# EAGLE design Battlebot_OSMC2 (EAGLE 5.10)
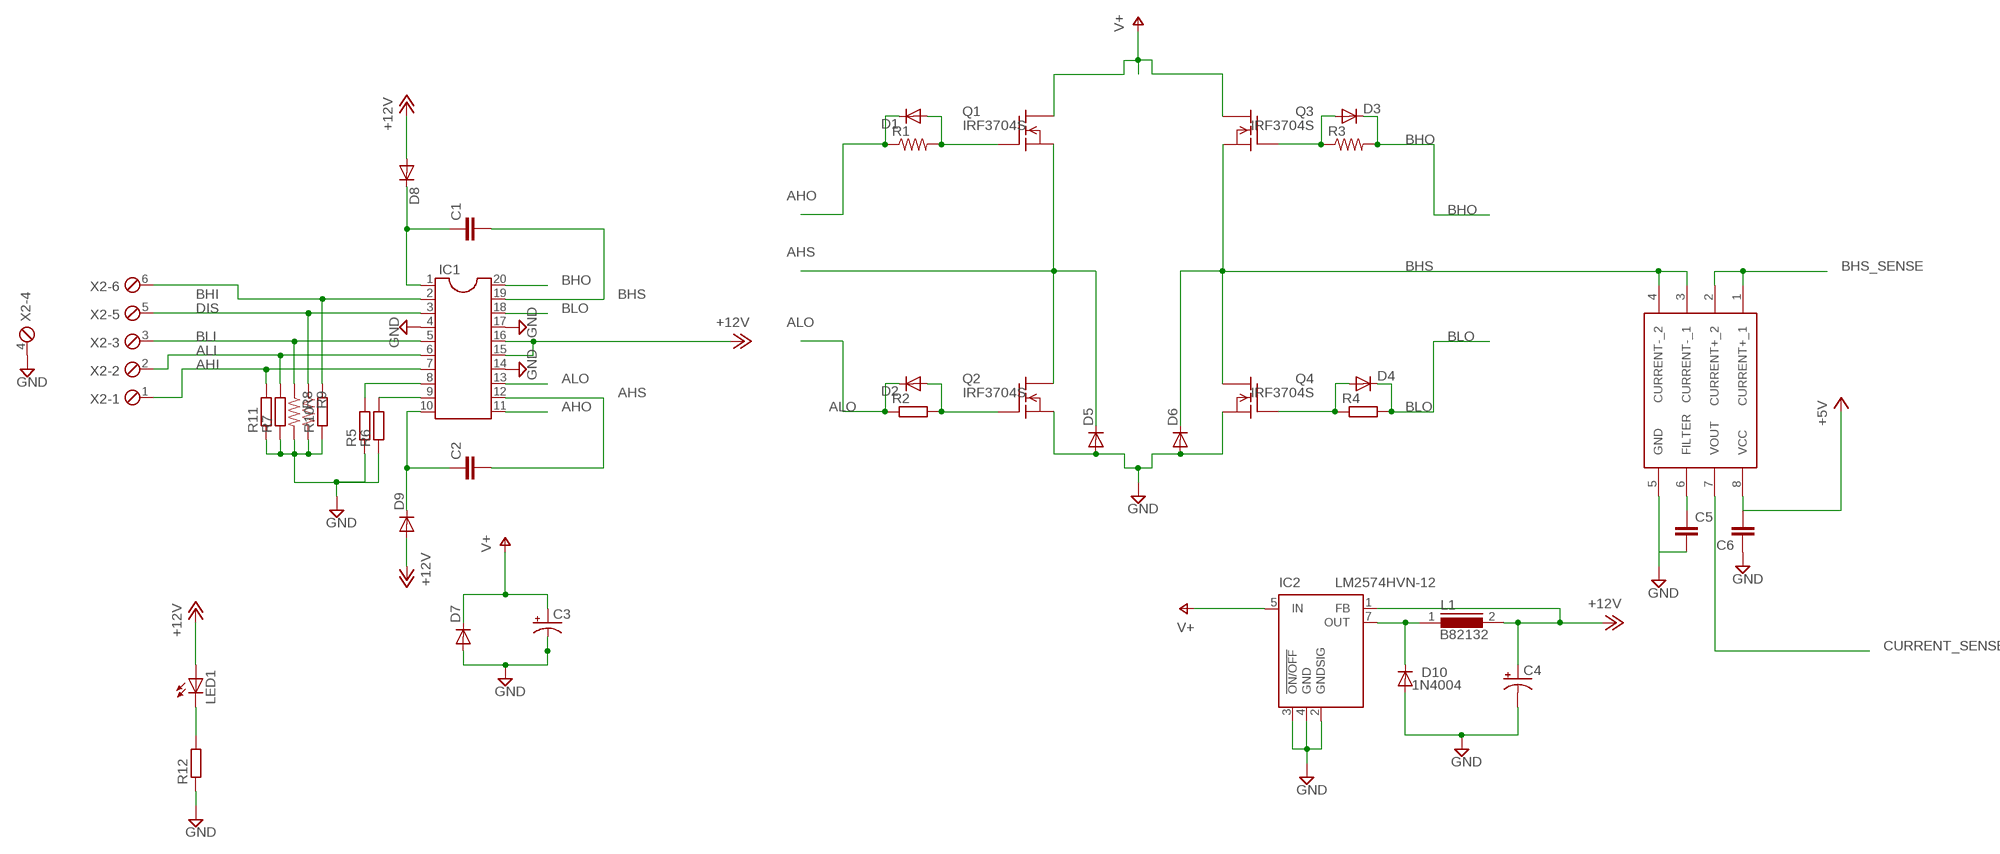
[diagram p0: schematic, sheet 1]

## Parts
C1  C7.5/3  [C7.5B3]
C2  C7.5/3  [C7.5B3]
C3  CPOL-USE5-10.5  [E5-10,5]
C4  CPOL-USE5-10.5  [E5-10,5]
C5  CAPPTH2  [CAP-PTH-SMALL2]
C6  CAPPTH2  [CAP-PTH-SMALL2]
D1  DIODE1N4148  [DIODE-1N4148]
D2  DIODE-D-5  [D-5]
D3  DIODE1N4148  [DIODE-1N4148]
D4  DIODE-D-5  [D-5]
D5  DIODE-C1702-05  [C1702-05]
D6  DIODE-C1702-05  [C1702-05]
D7  DIODE-C1702-05  [C1702-05]
D8  1N4148DO35-7  [DO35-7]
D9  1N4148DO35-7  [DO35-7]
D10  1N4004  [DO41-10]
IC1  DIL20  [DIL20]
IC2  LM2574HVN-12  [DIL08]
L1  B82132  [SUKW2-22]
LED1  LED3MM  [LED3MM]
Q1  IRF3704S  BUZ325V  [TO218V]
Q2  IRF3704S  BUZ325V  [TO218V]
Q3  IRF3704S  BUZ325V  [TO218V]
Q4  IRF3704S  BUZ325V  [TO218V]
R1  RESISTORPTH1  [AXIAL-0.3]
R2  R-EU_0204/5  [0204/5]
R3  RESISTORPTH1  [AXIAL-0.3]
R4  R-EU_0204/5  [0204/5]
R5  R-EU_0204/5  [0204/5]
R6  R-EU_0204/5  [0204/5]
R7  R-EU_0204/5  [0204/5]
R8  R-US_0204/2V  [0204V]
R9  R-US_0204/2V  [0204V]
R10  R-EU_0204/5  [0204/5]
R11  R-EU_0204/5  [0204/5]
R12  R-EU_0204/5  [0204/5]
U$1  ACS714  [ACS714]
X2  MPT6  [6POL254]

## Nets
+5V: C6.2 U$1.8(VCC)
+12V: C4.+ D8.A D9.A IC1.15 IC1.16 IC2.1(FB) L1.2 LED1.A
AHI: IC1.7 R11.2 X2.1
AHO: D1.C IC1.11 R1.P$1
AHS: C2.2 D5.C IC1.12 Q1.3(S) Q2.2(D)
ALI: IC1.6 R7.2 X2.2
ALO: D2.C IC1.13 R2.1
BHI: IC1.2 R10.2 X2.6
BHO: D3.C IC1.20 R3.P$2
BHS: C1.2 D6.C IC1.19 Q3.3(S) Q4.2(D) U$1.3(CURRENT-_1) U$1.4(CURRENT-_2)
BHS_SENSE: U$1.1(CURRENT+_1) U$1.2(CURRENT+_2)
BLI: IC1.5 R8.1 X2.3
BLO: D4.C IC1.18 R4.2
CURRENT_SENSE: U$1.7(VOUT)
DIS: IC1.3 R9.1 X2.5
GND: C3.- C4.- C5.2 C6.1 D5.A D6.A D7.A D10.A IC1.4 IC1.14 IC1.17 IC2.2(GNDSIG) IC2.3(!ON/OFF) IC2.4(GND) Q2.3(S) Q4.3(S) R5.1 R6.1 R7.1 R8.2 R9.2 R10.1 R11.1 R12.1 U$1.5(GND) X2.4
N$1: C2.1 D9.C IC1.10
N$2: C1.1 D8.C IC1.1
N$5: D1.A Q1.1(G) R1.P$2
N$6: D2.A Q2.1(G) R2.2
N$7: D4.A Q4.1(G) R4.1
N$8: D3.A Q3.1(G) R3.P$1
N$9: C5.1 U$1.6(FILTER)
N$10: D10.C IC2.7(OUT) L1.1
N$11: LED1.K(C) R12.2
N$14: IC1.8 R5.2
N$15: IC1.9 R6.2
V+: C3.+ D7.C IC2.5(IN) Q1.2(D) Q3.2(D)

## Library data of the parts
C1 C2 = capacitor-wima:C: CAPACITOR naming: grid - package width
C3 C4 = rcl:CPOL-US: POLARIZED CAPACITOR, American symbol
C5 C6 = SparkFun:CAP: Capacitor Standard 0603 ceramic capacitor, and 0.1" leaded capacitor.
D1 D3 = SparkFun:DIODE: Diode These are standard reverse protection diodes and small signal diodes. SMA package can handle up to about 1A. SOD-323 can handle about 200mA. What the SOD-323 package when ordering, there are some mfgs out there that are 5-pin packages.
D2 D4-D7 = diode:DIODE-: DIODE
D8 D9 = diode:1N4148: DIODE high speed (Philips)
D10 = diode:1N4004: DIODE general purpose rectifier, 1 A
IC1 = ic-package:DIL20: Dual In Line / Socket
IC2 = linear:LM2574?-*: SIMPLE SWITCHER 0.5A Step-Down Voltage Regulator Source: http://cache.national.com/ds/LM/LM2574.pdf
L1 = inductors:B82132: INDUCTOR
LED1 = SparkFun:LED: LEDs Standard schematic elements and footprints for 5mm, 3mm, 1206, and 0603 sized LEDs. 5mm - Spark Fun Electronics SKU : COM-00529 (and others)
Q1-Q4 = transistor-fet:BUZ325: N-Channel Enhancement MOSFET 400V; 10,5A; 0,5Ohm
R1 R3 = SparkFun:RESISTOR: Resistor Basic schematic elements and footprints for 0603, 1206, and PTH 1/10th watt (small) resistors.
R2 R4-R7 R10-R12 = rcl:R-EU_: RESISTOR, European symbol
R8 R9 = rcl:R-US_: RESISTOR, American symbol
U$1 = A-JD3:ACS714
X2 = con-phoenix-254:MPT6: PHOENIX CONNECTOR

## Board
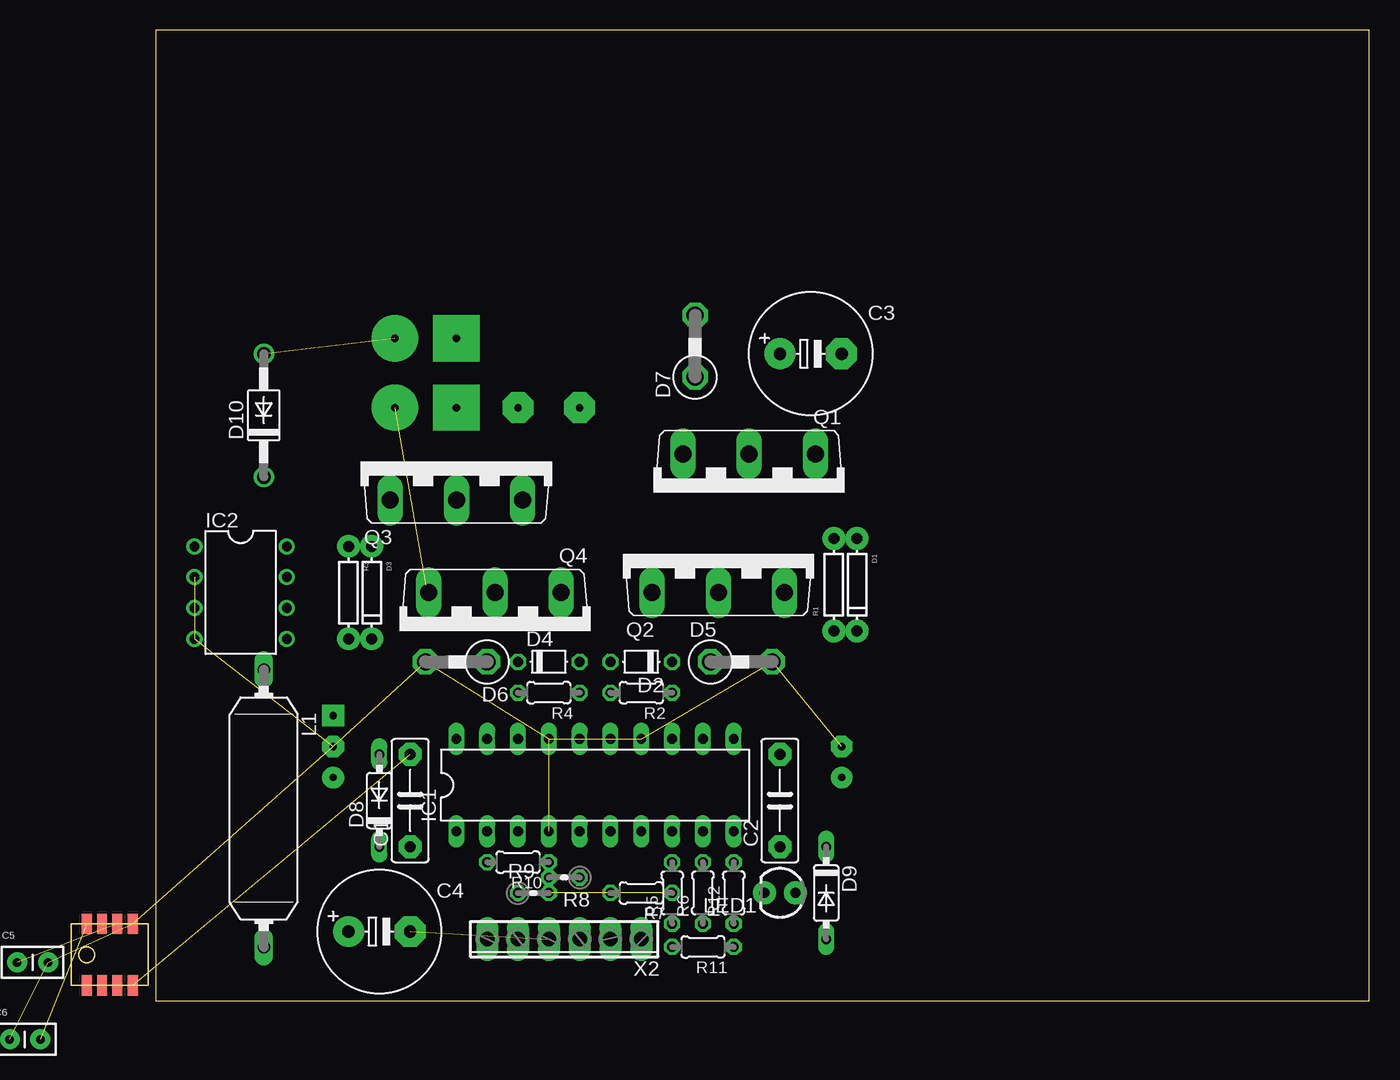
[diagram p1: board, top side]
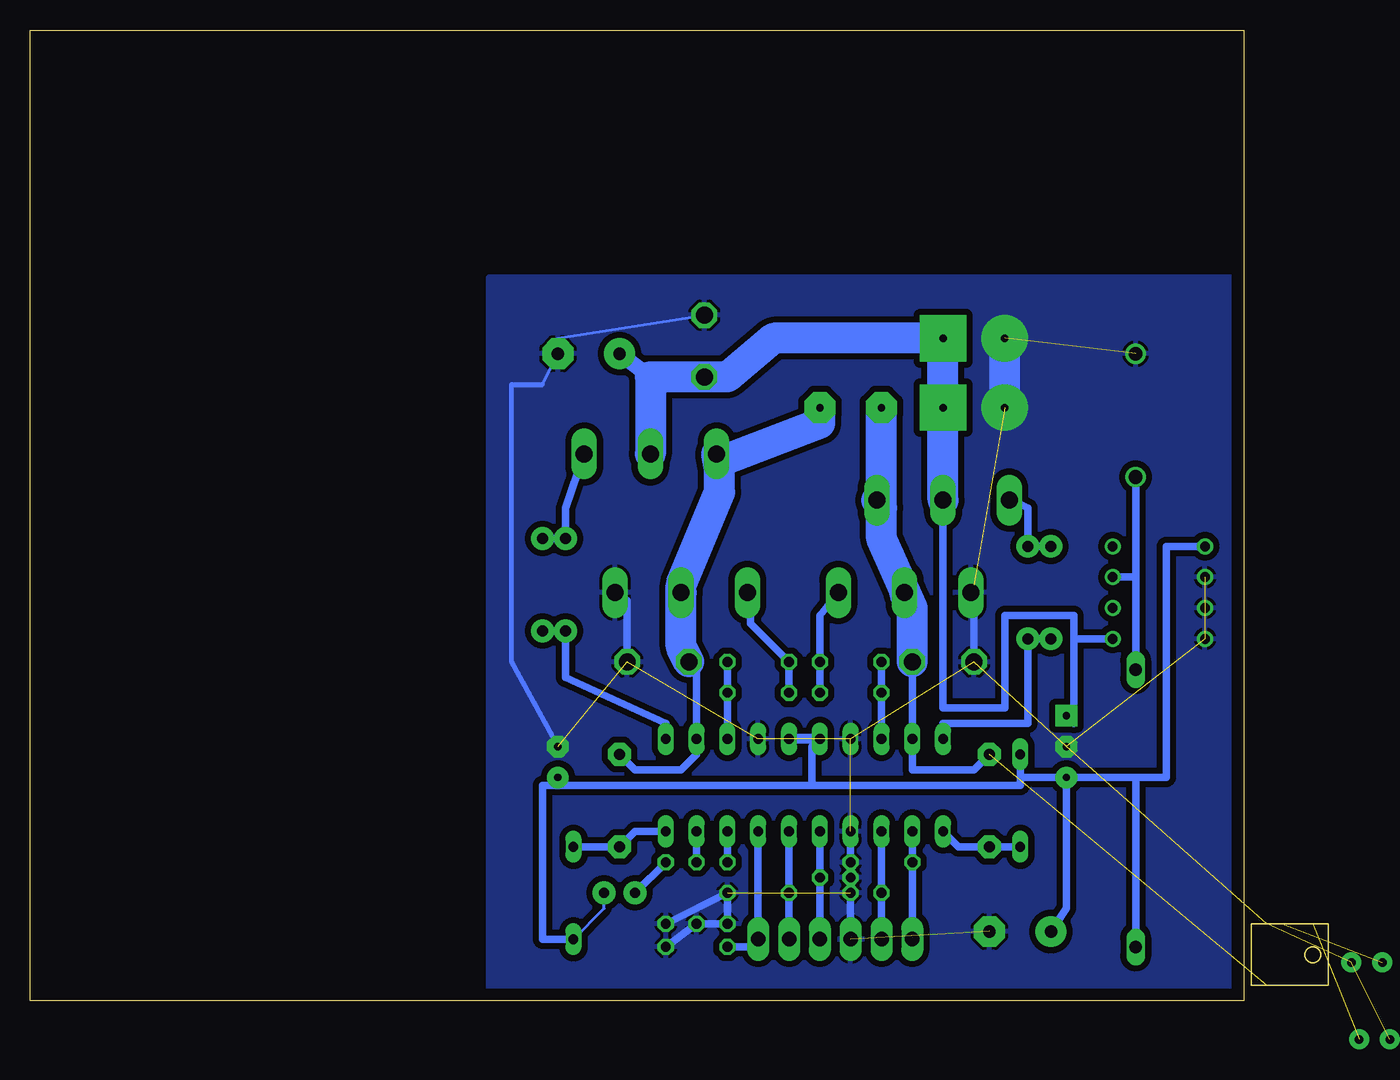
[diagram p2: board, bottom side, seen from below]

Size 100 x 80 mm. Coordinates in mm from the lower left corner, seen from the top.
Outline: 0,0 100,0 100,80 0,80 0,0
Copper layers (1*16): Top 0.035mm / dielectric 1.5mm / Bottom 0.035mm
Design rules "default *": minimum track width 10mil, minimum drill 24mil, track to track 20mil, track to pad 20mil, pad to pad 8mil, via to via 8mil, smd to smd 8mil, copper to edge 40mil, drill to drill 8mil, minimum pad ring 10mil, minimum via ring 8mil, stop-mask expansion 4mil, vias tented up to drill 0mil, thermal gap 10mil

### Footprints (pad centres in the part's own frame; a part is rotated, then mirrored left to right if it is on the bottom)
C7.5B3 = drill 0.914 pad 1.905 octagon: 1 -3.81,0; 2 3.81,0
E5-10,5 = drill 1.016 pad 2.54 round: + -2.54,0 | drill 1.016 pad 2.54 octagon: - 2.54,0
CAP-PTH-SMALL2 = drill 0.7 pad 1.651 round: 1 0,0; 2 2.54,0
DIODE-1N4148 = drill 0.9 pad 1.88 round: A -3.81,0; C 3.81,0
D-5 = drill 0.813 octagon: A 2.54,0; C -2.54,0
C1702-05 = drill 1.397 octagon: A 2.54,0; C -2.54,0
DO35-7 = drill 0.813 long: A 3.81,0; C -3.81,0
DO41-10 = drill 1.118 round: A 5.08,0; C -5.08,0
DIL20 = drill 0.813 long: 1 -11.43,-3.81; 2 -8.89,-3.81; 3 -6.35,-3.81; 4 -3.81,-3.81; 5 -1.27,-3.81; 6 1.27,-3.81; 7 3.81,-3.81; 8 6.35,-3.81; 9 8.89,-3.81; 10 11.43,-3.81; 11 11.43,3.81; 12 8.89,3.81; 13 6.35,3.81; 14 3.81,3.81; 15 1.27,3.81; 16 -1.27,3.81; 17 -3.81,3.81; 18 -6.35,3.81; 19 -8.89,3.81; 20 -11.43,3.81
DIL08 = drill 0.813 pad 1.27 round: 1 -3.81,-3.81; 2 -1.27,-3.81; 3 1.27,-3.81; 4 3.81,-3.81; 5 3.81,3.81; 6 1.27,3.81; 7 -1.27,3.81; 8 -3.81,3.81
SUKW2-22 = drill 1.016 long: 1 -11.43,0; 2 11.43,0
LED3MM = drill 0.813 pad 1.88 round: A -1.27,0; K 1.27,0
TO218V = drill 1.397 long: 1 -5.461,-3.175; 2 0,-3.175; 3 5.461,-3.175
AXIAL-0.3 = drill 0.9 pad 1.88 round: P$1 -3.81,0; P$2 3.81,0
0204/5 = drill 0.813 octagon: 1 -2.54,0; 2 2.54,0
0204V = drill 0.813 octagon: 1 -1.27,0; 2 1.27,0
ACS714 = smd 0.813 x 1.676: 1 -1.905,-2.54; 2 -0.635,-2.54; 3 0.635,-2.54; 4 1.905,-2.54; 5 1.905,2.54; 6 0.635,2.54; 7 -0.635,2.54; 8 -1.905,2.54
6POL254 = drill 1.2 pad 1.778 long: 1 -6.35,0; 2 -3.81,0; 3 -1.27,0; 4 1.27,0; 5 3.81,0; 6 6.35,0

### Placement (x,y rotation side)
C1  20.95,16.51 90 top
C2  51.44,16.51 90 top
C3  53.98,53.34 0 top
C4  18.41,5.71 0 top
C5  -11.43,3.17 0 top  (outside the outline)
C6  -12.06,-3.17 0 top  (outside the outline)
D1  57.78,34.29 270 top
D2  40.01,27.94 180 top
D3  17.78,33.66 270 top
D4  32.38,27.94 0 top
D5  48.26,27.94 0 top
D6  24.77,27.94 180 top
D7  44.45,53.98 90 top
D8  18.41,16.51 90 top
D9  55.24,8.89 270 top
D10  8.89,48.26 90 top
IC1  36.2,17.78 0 top
IC2  6.99,33.66 270 top
L1  8.89,15.88 270 top
LED1  51.44,8.89 180 top
Q1  48.9,41.91 180 top
Q2  46.35,36.83 0 top
Q3  24.77,44.45 0 top
Q4  27.94,30.48 180 top
R1  55.88,34.29 90 top
R2  40.01,25.4 180 top
R3  15.88,33.66 270 top
R4  32.38,25.4 180 top
R5  42.55,8.89 90 top
R6  45.09,8.89 90 top
R7  40.01,8.89 180 top
R8  33.66,10.16 180 top
R9  31.11,8.89 0 top
R10  29.84,11.43 180 top
R11  45.09,4.45 180 top
R12  47.62,8.89 90 top
U$1  -3.81,3.81 0 top
X2  33.66,5.08 180 top

### Tracks (layer width: path | path; a pad name or v marks a point on that pad's centre or on a via)
+5V  (1 unrouted)
+12V  (via drill 0.6 pad 1.78)
  Bottom 0.254: D9.A 52.7,7.62 LED1.A | 35.56,20.95 IC1.16
  Bottom 0.61: v14.61,18.41 18.41,18.41 | 18.41,18.41 18.41,17.78 35.56,17.78 | 18.41,18.41 D8.A | 8.89,18.41 v14.61,18.41 | 35.56,17.78 35.56,20.95 | v14.61,18.41 14.61,7.62 C4.+ | IC2.1 6.35,37.47 6.35,18.41 8.89,18.41 | L1.2 8.89,18.41 | 35.56,17.78 57.78,17.78 57.78,5.08 D9.A
  Bottom 0.813: IC1.16 IC1.15
AHI
  Bottom 0.61: R11.2 40.01,4.45 X2.1 IC1.7
AHO
  Bottom 0.61: IC1.11 47.62,22.86 55.88,26.67 R1.P$1 D1.C
AHS  (via drill 0.6 pad 2.54)
  Bottom 0.61: D5.C 45.72,27.3 45.09,27.3 IC1.12 45.09,20.32 46.35,19.05 50.16,19.05 C2.2
  Bottom 2.54: D5.C 46.35,29.21 Q2.2 46.35,34.29 43.18,41.91 43.18,43.81 | 43.18,43.81 43.18,44.45 34.92,47.62 v34.92,48.9 | 43.18,43.81 Q1.3
ALI
  Bottom 0.61: IC1.6 R7.2 X2.2
ALO
  Bottom 0.61: IC1.13 R2.1 D2.C
BHI
  Bottom 0.61: IC1.2 R10.2 X2.6
BHO
  Bottom 0.61: IC1.20 24.77,22.86 17.78,22.86 D3.C R3.P$2
BHS  (via drill 0.6 pad 2.54)  (2 unrouted)
  Bottom 0.61: IC1.19 D6.C 27.3,19.05 22.23,19.05 C1.2
  Bottom 2.54: 29.84,40.64 Q3.3 | 29.84,40.64 29.84,38.1 27.3,32.38 | 27.3,32.38 Q4.2 | D6.C 27.3,32.38 | 29.84,40.64 v29.84,48.9
BHS_SENSE  (1 unrouted)
BLI
  Bottom 0.61: IC1.5 R8.1 X2.3
BLO
  Bottom 0.61: IC1.18 R4.2 D4.C
DIS
  Bottom 0.61: X2.5 R9.1 IC1.3
GND  (via drill 0.6 pad 1.78, 0.6 pad 3.81)  (16 unrouted)
  Bottom 0.254: D7.A 56.52,54.61 C3.- 57.78,50.8 | 50.8,33.02 Q2.3 | 22.23,34.29 Q4.3
  Bottom 0.406: v56.52,20.95 60.33,27.94 60.33,50.8 57.78,50.8
  Bottom 0.61: R11.1 R6.1 R5.1 R7.1 R12.1 | IC1.4 R10.1 R8.2 R9.2 X2.4 | D5.A 50.8,33.02 | D6.A 22.23,34.29
  Bottom 2.54: v19.68,48.9 v19.68,54.61
  other vias: 14.61,20.95
  pour Bottom: 0.64,59.69 0.64,0.64 62.23,0.64 62.23,59.69
N$1
  Bottom 0.61: IC1.10 50.16,13.97 C2.1 D9.C
N$2
  Bottom 0.61: D8.C C1.1 23.5,12.7 IC1.1
N$4  (via drill 0.6 pad 1.78)
  other vias: 56.52,18.41
N$5
  Bottom 0.61: D1.A R1.P$2 55.88,40.64 Q1.1
N$6
  Bottom 0.61: R2.2 D2.A 40.64,31.11 40.64,33.66 Q2.1
N$7
  Bottom 0.61: R4.1 D4.A 34.92,31.75 Q4.1
N$8
  Bottom 0.61: R3.P$1 D3.A 17.78,40.64 19.05,41.27 Q3.1
N$9  (1 unrouted)
N$10
  Bottom 0.61: L1.1 8.89,34.92 | 8.89,34.92 IC2.7 | 8.89,34.92 D10.C
N$11
  Bottom 0.61: R12.2 LED1.K
N$14
  Bottom 0.61: R5.2 IC1.8
N$15
  Bottom 0.61: R6.2 IC1.9
V+  (via drill 0.6 pad 1.78, 0.6 pad 3.81)
  Bottom 0.406: v14.61,23.5 13.97,23.5 | 13.97,23.5 13.97,29.84 | 13.97,23.5 13.97,22.86
  Bottom 0.61: 13.97,29.84 13.97,31.75 19.68,31.75 19.68,24.13 24.77,24.13 Q3.2 | 13.97,29.84 IC2.5 | 13.97,29.84 13.97,22.86
  Bottom 1.27: 48.9,51.44 C3.+
  Bottom 2.54: Q1.2 48.9,51.44 D7.C 42.55,51.44 38.73,54.61 v24.77,54.61 v24.77,48.9 Q3.2